# Altium project e.PrjPcb
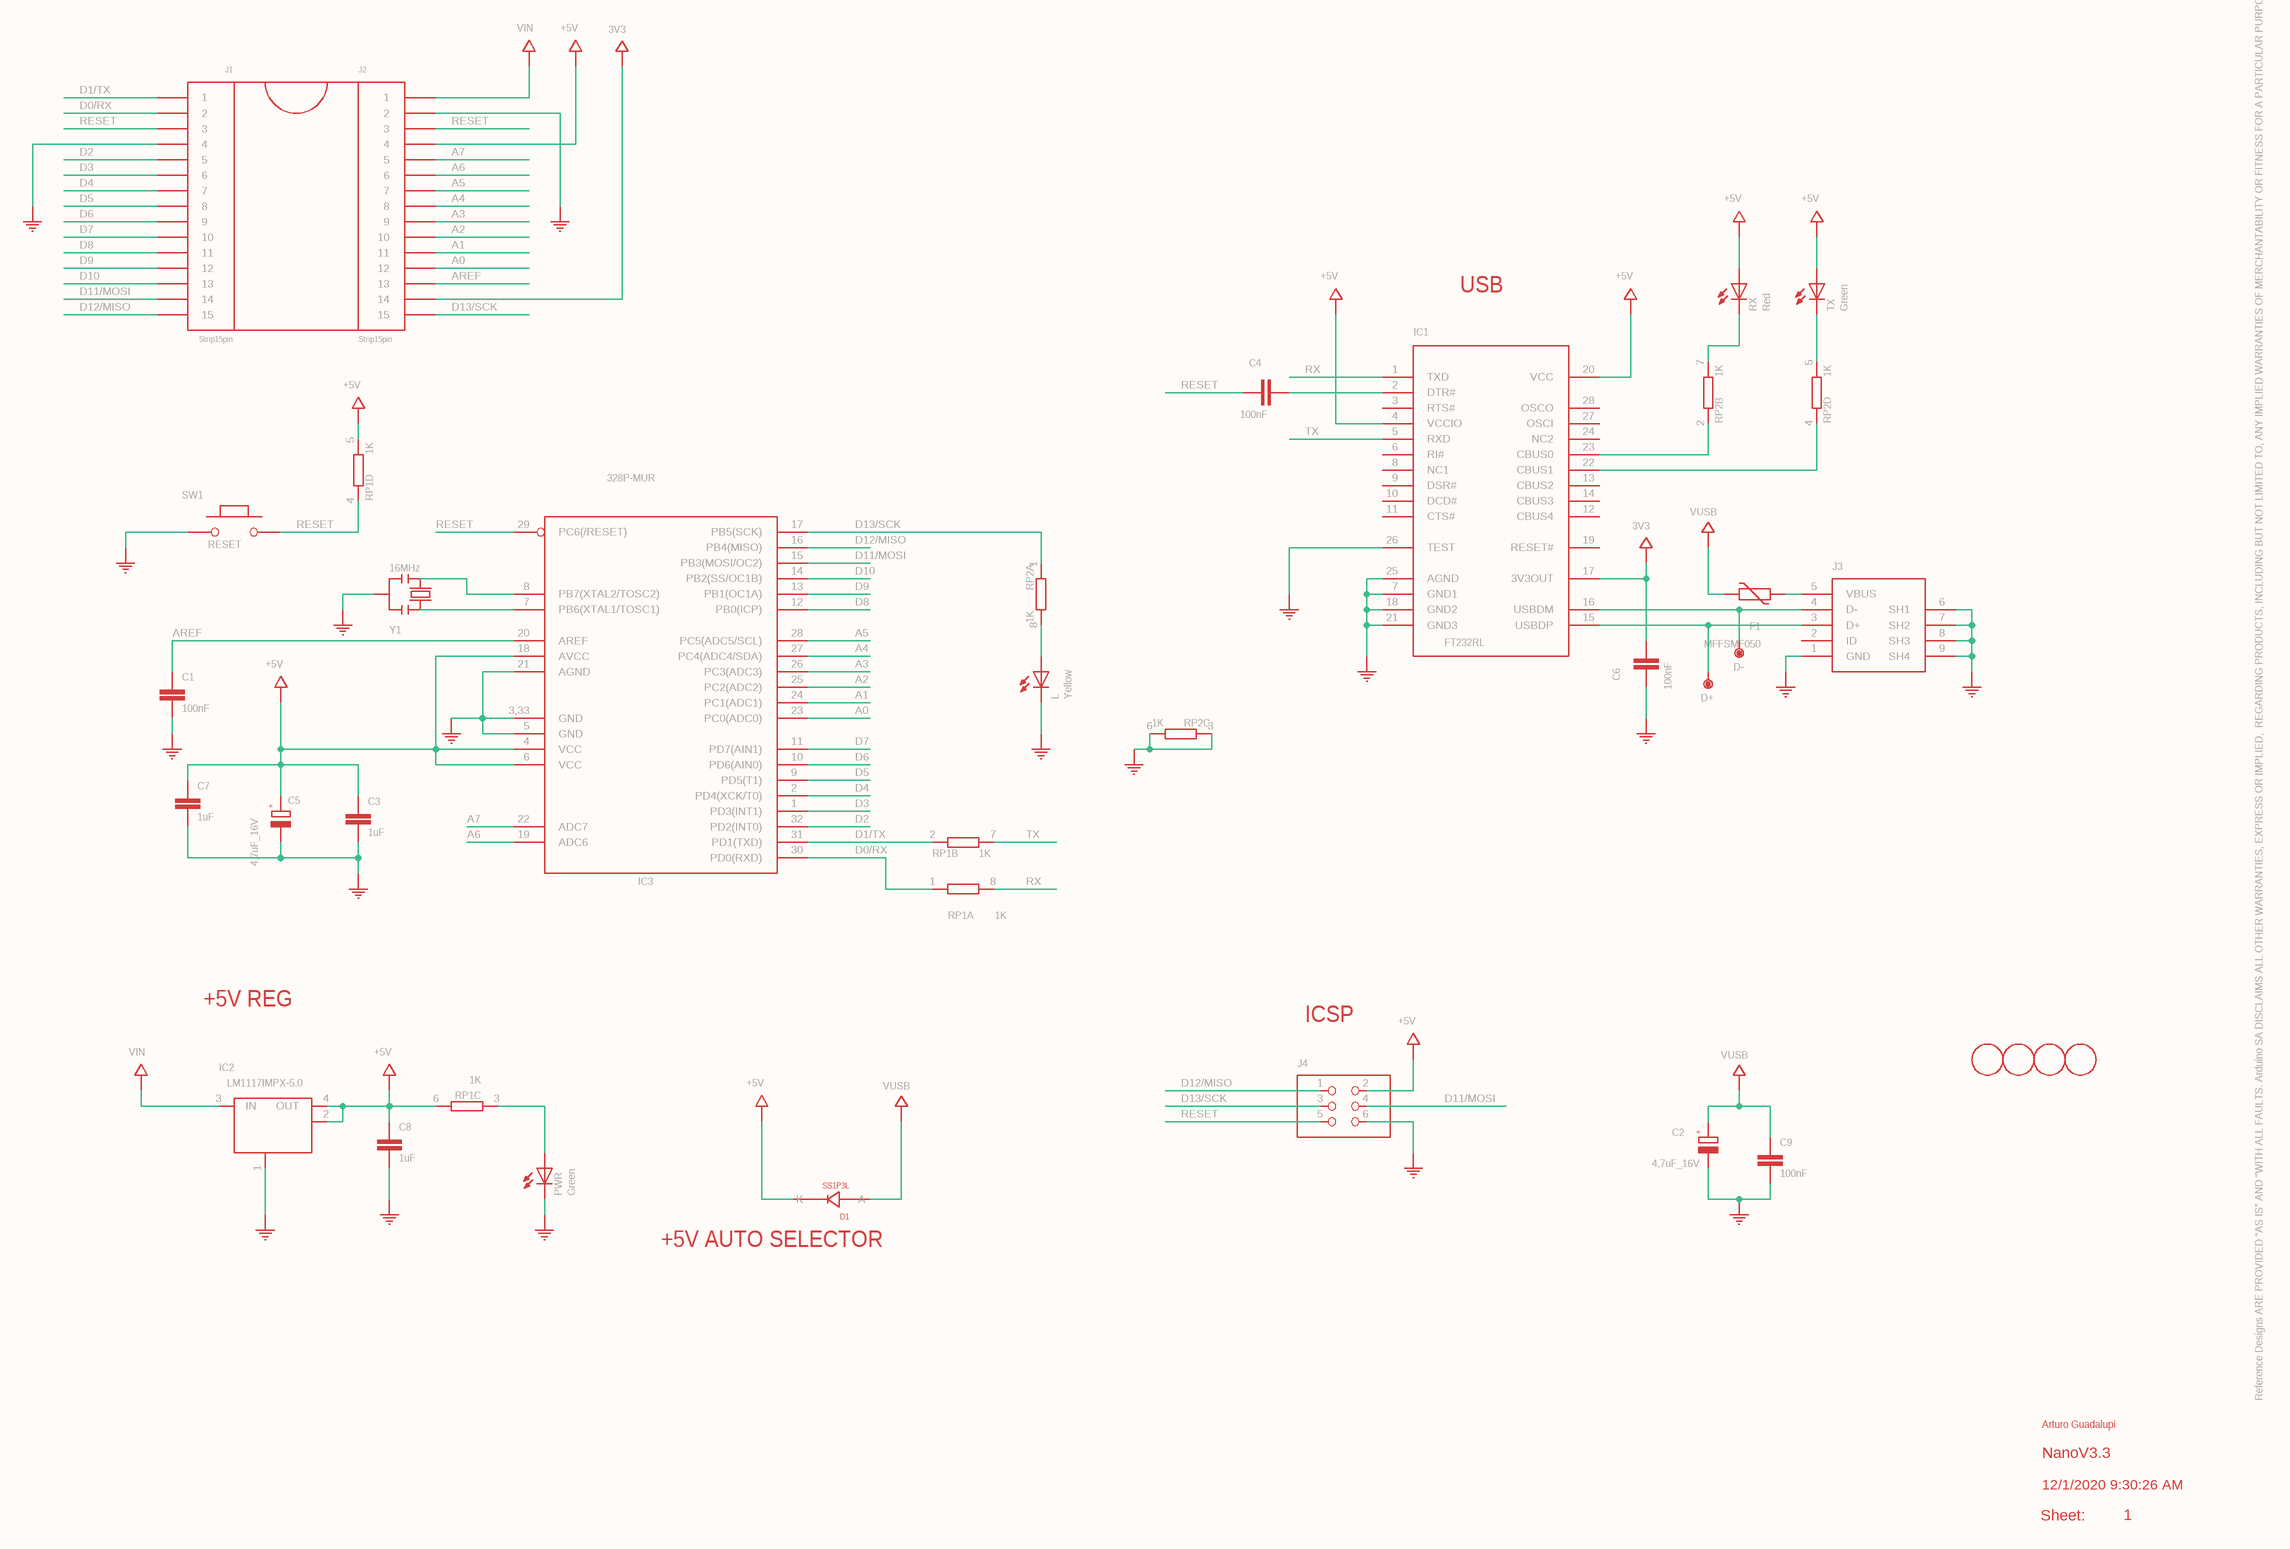
[diagram p0: NanoV3.3.SchDoc]
1 sheet, 68 parts. Net scope: global (net labels, ports and power ports of the same name join across sheets).
Board file: NanoV3.3.PcbDoc

## Sheet NanoV3.3.SchDoc: NanoV3.3
size 409 x 289 mm; Origin: Eagle; Date: 12/1/2020 9:30:26 AM; SheetNumber: 1; CODE-ARDUINO: DNP; DATASHEET: DNP; DISTRIBUTOR-LINK: DNP; DISTRIBUTOR-PN: DNP; MANUFACTURER: DNP; MANUFACTURER-PN: DNP; NOTE: DNP; Value: DNP; GateName_1: G$1; SymbolName_1: A3L-LOC; LibraryName: Arduino-utility; DeviceSetName: A3-FRAME; Sheet: Sheet:; ReferenceDesignsAREPROVIDED"ASIS"AND"WITHALLFAULTS.ArduinoSADISCLAIMSALLOTHERWARRANTIES,EXPRESSORIMPLIED,
REGARDINGPRODUCTS,INCLUDINGBUTNOTLIMITEDTO,ANYIMPLIEDWARRANTIESOFMERCHANTABILITYORFITNESSFORAPARTICULARPURPOSE

ArduinoSAmaymakechangestospecificationsandproductdescriptionsatanytime,withoutnotice.TheCustomermustnot
relyontheabsenceorcharacteristicsofanyfeaturesorinstructionsmarked"reserved"or"undefined."ArduinoSAreserves
theseforfuturedefinitionandshallhavenoresponsibilitywhatsoeverforconflictsorincompatibilitiesarisingfromfuturechangestothem.
TheproductinformationontheWebSiteorMaterialsissubjecttochangewithoutnotice.Donotfinalizeadesignwiththisinfo

ARDUINOandotherArduinobrandsandlogosandTrademarksofArduinoSA.AllArduinoSATrademarkscannotbeusedwithoutowner'sformalpermission: Reference Designs ARE PROVIDED "AS IS" AND "WITH ALL FAULTS. Arduino SA DISCLAIMS ALL OTHER WARRANTIES, EXPRESS OR IMPLIED, / REGARDING PRODUCTS, INCLUDING BUT NOT LIMITED TO, ANY IMPLIED WARRANTIES OF MERCHANTABILITY OR FITNESS FOR A PARTICULAR PURPOSE / Arduino SA may make changes to specifications and product descriptions at any time, without notice. The Customer must not / rely on the absence or characteristics of any features or instructions marked "reserved" or "undefined." Arduino SA reserves / these for future definition and shall have no responsibility whatsoever for conflicts or incompatibilities arising from future changes to them. / The product information on the Web Site or Materials is subject to change without notice. Do not finalize a design with this info / ARDUINO and other Arduino brands and logos and Trademarks of Arduino SA. All Arduino SA Trademarks cannot be used without owner's formal permission

### Parts
C1  100nF  [C0603-ROUND]
C2  4,7uF_16V  [TAN-A]
C3  1uF  [C0603-ROUND]
C4  100nF  [C0603-ROUND]
C5  4,7uF_16V  [TAN-A]
C6  100nF  [C0603-ROUND]
C7  1uF  [C0603-ROUND]
C8  1uF  [C0603-ROUND]
C9  100nF  [C0603-ROUND]
D1  SS1P3L  [DO220AAL]
D+  DNP  [TP-1.00MM]  (value not drawn)
D-  DNP  [TP-1.00MM]  (value not drawn)
F1  MFFSMF050  [0603-1608X90N]
IC1  FT232RL  [SSOP28]
IC2  LM1117IMPX-5.0  [LINEAR_SOT223]
IC3  328P-MUR  [VQFN32]
J1  Strip15pin  [HEAD15-NOSS]
J2  Strip15pin  [HEAD15-NOSS]
J3  USB-mini-90 -SMD  [USB-MINI-B_2]  (value not drawn)
J4  ICSP  [2X03]  (value not drawn)
L  Yellow  [CHIPLED_0805]
PWR  Green  [CHIPLED_0805]
RP1  1K  [CAY16]  (parts A,B,C,D of 4)
RP2  1K  [CAY16]  (parts A,B,C,D of 4)
RX  Red  [CHIPLED_0805]
SW1  RESET  [SMD_157SW]
TX  Green  [CHIPLED_0805]
U$1  COM  (value not drawn)
U$2  COM  (value not drawn)
U$3  COM  (value not drawn)
U$4  DNP  [FD-1-1.5]  (value not drawn)
U$5  DNP  [FD-1-1.5]  (value not drawn)
U$6  +5V
U$7  VIN
U$8  3V3
U$9  COM  (value not drawn)
U$10  COM  (value not drawn)
U$11  +5V
U$12  +5V
U$13  COM  (value not drawn)
U$14  +5V
U$15  +5V
U$16  COM  (value not drawn)
U$17  COM  (value not drawn)
U$18  +5V
U$19  VIN
U$20  COM  (value not drawn)
U$21  VUSB
U$22  VUSB
U$23  VUSB
U$24  COM  (value not drawn)
U$25  +5V
U$26  3V3
U$27  COM  (value not drawn)
U$28  COM  (value not drawn)
U$29  COM  (value not drawn)
U$30  COM  (value not drawn)
U$31  +5V
U$32  COM  (value not drawn)
U$33  COM  (value not drawn)
U$34  COM  (value not drawn)
U$35  +5V
U$51  COM  (value not drawn)
U$52  COM  (value not drawn)
U$53  DNP  [FD-1-1.5]  (value not drawn)
U$54  DNP  [FD-1-1.5]  (value not drawn)
U$55  +5V
Y1  16MHz  [RESONATOR]

### Nets
A0: IC3.23(PC0(ADC0)) J2.12
A1: IC3.24(PC1(ADC1)) J2.11
A2: IC3.25(PC2(ADC2)) J2.10
A3: IC3.26(PC3(ADC3)) J2.9
A4: IC3.27(PC4(ADC4/SDA)) J2.8
A5: IC3.28(PC5(ADC5/SCL)) J2.7
A6: IC3.19(ADC6) J2.6
A7: IC3.22(ADC7) J2.5
AREF: C1.1 IC3.20(AREF) J2.13
D0/RX: IC3.30(PD0(RXD)) J1.2 RP1.1
D1/TX: IC3.31(PD1(TXD)) J1.1 RP1.2
D2: IC3.32(PD2(INT0)) J1.5
D3: IC3.1(PD3(INT1)) J1.6
D4: IC3.2(PD4(XCK/T0)) J1.7
D5: IC3.9(PD5(T1)) J1.8
D6: IC3.10(PD6(AIN0)) J1.9
D7: IC3.11(PD7(AIN1)) J1.10
D8: IC3.12(PB0(ICP)) J1.11
D9: IC3.13(PB1(OC1A)) J1.12
D10: IC3.14(PB2(SS/OC1B)) J1.13
D11/MOSI: IC3.15(PB3(MOSI/OC2)) J1.14 J4.4
D12/MISO: IC3.16(PB4(MISO)) J1.15 J4.1
D13/SCK: IC3.17(PB5(SCK)) J2.15 J4.3 RP2.1
RESET: C4.1 IC3.29(PC6(/RESET)) J1.3 J2.3 J4.5 RP1.4 SW1.2
RX: IC1.1(TXD) RP1.8
TX: IC1.5(RXD) RP1.7
NetC1_2: C1.2 U$10.?1(COM)
NetC2_1: C2.1(+) C9.1 U$23.?1(VUSB)
NetC2_2: C2.2(-) C9.2 U$17.?1(COM)
NetC3_1: C3.1 C5.1(+) C7.1 IC3.4(VCC) IC3.6(VCC) IC3.18(AVCC) U$55.?1(+5V)
NetC3_2: C3.2 C5.2(-) C7.2 U$16.?1(COM)
NetC4_2: C4.2 IC1.2(DTR#)
NetC6_1: C6.1 U$27.?1(COM)
NetC6_2: C6.2 IC1.17(3V3OUT) U$26.?1(3V3)
NetC8_1: C8.1 IC2.2(OUT) IC2.4(OUT) RP1.6 U$18.?1(+5V)
NetC8_2: C8.2 U$20.?1(COM)
NetD1_P$1: D1.P$1(K) U$15.?1(+5V)
NetD1_P$2: D1.P$2(A) U$21.?1(VUSB)
NetD+_X: D+.X(P$1) IC1.15(USBDP) J3.3(D+)
NetD-_X: D-.X(P$1) IC1.16(USBDM) J3.4(D-)
NetF1_1: F1.1 U$22.?1(VUSB)
NetF1_2: F1.2 J3.5(VBUS)
NetIC1_4: IC1.4(VCCIO) U$11.?1(+5V)
NetIC1_7: IC1.7(GND1) IC1.18(GND2) IC1.21(GND3) IC1.25(AGND) U$24.?1(COM)
NetIC1_20: IC1.20(VCC) U$14.?1(+5V)
NetIC1_22: IC1.22(CBUS1) RP2.4
NetIC1_23: IC1.23(CBUS0) RP2.2
NetIC1_26: IC1.26(TEST) U$51.?1(COM)
NetIC2_1: IC2.1(GND/ADJ) U$32.?1(COM)
NetIC2_3: IC2.3(IN) U$19.?1(VIN)
NetIC3_3,33: IC3.3,33(GND) IC3.5(GND) IC3.21(AGND) U$52.?1(COM)
NetIC3_7: IC3.7(PB6(XTAL1/TOSC1)) Y1.1
NetIC3_8: IC3.8(PB7(XTAL2/TOSC2)) Y1.3
NetJ1_4: J1.4 U$1.?1(COM)
NetJ2_1: J2.1 U$7.?1(VIN)
NetJ2_2: J2.2 U$2.?1(COM)
NetJ2_4: J2.4 U$6.?1(+5V)
NetJ2_14: J2.14 U$8.?1(3V3)
NetJ3_1: J3.1(GND) U$29.?1(COM)
NetJ3_6: J3.6(SH1) J3.7(SH2) J3.8(SH3) J3.9(SH4) U$30.?1(COM)
NetJ4_2: J4.2 U$12.?1(+5V)
NetJ4_6: J4.6 U$3.?1(COM)
NetL_A: L.A RP2.8
NetL_C: L.C U$34.?1(COM)
NetPWR_A: PWR.A RP1.3
NetPWR_C: PWR.C U$33.?1(COM)
NetRP1_5: RP1.5 U$31.?1(+5V)
NetRP2_3: RP2.3 RP2.6 U$9.?1(COM)
NetRP2_5: RP2.5 TX.C
NetRP2_7: RP2.7 RX.C
NetRX_A: RX.A U$25.?1(+5V)
NetSW1_1: SW1.1 U$28.?1(COM)
NetTX_A: TX.A U$35.?1(+5V)
NetU$13_?1: U$13.?1(COM) Y1.2

Not connected (* = marked no-connect by the designer): IC1 3(RTS#) 6(RI#) 8(NC1) 9(DSR#) 10(DCD#) 11(CTS#) 12(CBUS4) 13(CBUS2) 14(CBUS3) 19(RESET#) 24(NC2) 27(OSCI) 28(OSCO); J3 2(ID)

### Notes on the sheet
- USB
- +5V REG
- ICSP
- (near D1) +5V AUTO SELECTOR
- Reference Designs ARE PROVIDED "AS IS" AND "WITH ALL FAULTS. Arduino SA DISCLAIMS ALL OTHER WARRANTIES, EXPRESS OR IMPLIED,
  REGARDING PRODUCTS, INCLUDING BUT NOT LIMITED TO, ANY IMPLIED WARRANTIES OF MERCHANTABILITY OR FITNESS FOR A PARTICULAR PURPOSE
  Arduino SA may make changes to specifications and product descriptions at any time, without notice. The Customer must not
  rely on the absence or characteristics of any features or instructions marked "reserved" or "undefined." Arduino SA reserves
  these for future definition and shall have no responsibility whatsoever for conflicts or incompatibilities arising from future changes to them.
  The product information on the Web Site or Materials is subject to change without notice. Do not finalize a design with this info
  ARDUINO and other Arduino brands and logos and Trademarks of Arduino SA. All Arduino SA Trademarks cannot be used without owner's formal permission
- Arturo Guadalupi
- NanoV3.3
- Sheet:
- 12/1/2020 9:30:26 AM
- 1

### Library data of the parts
C1 C4 C6 C9 = 0015_100NF_0603: 100nF 0603 50V; PART_NUMBER: cl10b104kbnc; GateName_1: G$1; SymbolName_1: C-EU; MONTHLY_USAGE: _____; TYPE: Condensatori; LibraryName: Condensatori; DeviceSetName: 0015_100NF_0603; CASE: 0603; PRICE: _____; SUPPLIER: _____
C2 C5 = 0833_TAJA475MO16RNJ: 4,7uF; GateName_1: G$1; SymbolName_1: CPOL; MONTHLY_USAGE: _____; TYPE: Condensatori; LibraryName: Condensatori; DeviceSetName: 0833_TAJA475MO16RNJ; +: +; CASE: Case_A_(1206); PART_NUMBER: TAJA475MO16RNJ; PRICE: _____; SUPPLIER: _____
C3 C7 C8 = 0006_1UF_0603/GRM188R61E105KA12D: 1uF 0603; GateName_1: G$1; SymbolName_1: C-EU; MONTHLY_USAGE: _____; TYPE: Condensatori; LibraryName: Condensatori; DeviceSetName: 0006_1UF_0603/GRM188R61E105KA12D; CASE: 0603; PART_NUMBER: 1uF_0603/GRM188R61E105KA12D; PRICE: _____; SUPPLIER: _____
D1 = 0025_SS1P3L-M3/84A: 1A 30V Schottky Barrier Rectifiers -SS1P3L-M3/84A; GateName_1: G$1; SymbolName_1: DIODE; MONTHLY_USAGE: _____; TYPE: Diodi; LibraryName: Diodi; DeviceSetName: 0025_SS1P3L-M3/84A; CASE: SMP; PART_NUMBER: SS1P3L-M3/84A; PRICE: _____; SUPPLIER: _____
D+ D- = TPTP-1.00MM: Testpoint; GateName_1: G$1; DeviceSetName: TP; SymbolName_1: TESTPOINT; DeviceName: TP-1.00MM; LibraryName: Arduino-utility; DATASHEET: DNP; DISTRIBUTOR-LINK: DNP; DISTRIBUTOR-PN: DNP; MANUFACTURER: DNP; MANUFACTURER-PN: DNP
F1 = PTC: SMD PTC; MANUFACTURER: Bourns Inc; MANUFACTURER-PN: MF-FSMF050X-2; GateName_1: G$1; SymbolName_1: PTC; LibraryName: Arduino-rcl; DeviceSetName: PTC; DATASHEET: http://www.bourns.com/docs/Product-Datasheets/mffsmf.pdf; DISTRIBUTOR-LINK: http://www.digikey.com/product-detail/en/bourns-inc/MF-FSMF050X-2/MF-FSMF050X-2CT-ND/2039389; DISTRIBUTOR-PN: MF-FSMF050X-2CT-ND
IC1 = 0226_FT232RL: USB to serial UART interface -FT232RL; GateName_1: G$1; SymbolName_1: FL232RL; MONTHLY_USAGE: _____; LibraryName: IntegratedCircuits; DeviceSetName: 0226_FT232RL; CASE: SSOP28; PART_NUMBER: FT232RL; PRICE: _____; SUPPLIER: _____; TYPE: Circuito_Integrato
IC2 = 0022_LM1117IMPX-5.0: Low-dropout linear regulator 5V  -LM1117IMPX-5.0; GateName_1: G$1; SymbolName_1: LINEAR_VREG-O2; MONTHLY_USAGE: _____; LibraryName: IntegratedCircuits; DeviceSetName: 0022_LM1117IMPX-5.0; CASE: SOT223; PART_NUMBER: LM1117IMPX-5.0; PRICE: _____; SUPPLIER: _____; TYPE: Circuito_Integrato
IC3 = ATMEGA328P-32MUR: 8-bit Microcontroller with 32KBytes In-System Programmable Flash   ATMEGA328P-AU; MANUFACTURER: ATMEL; MANUFACTURER-PN: ATMEGA328P-MUR; GateName_1: G$1; SymbolName_1: 23-I/O; DeviceName: MUR; LibraryName: Arduino-ucs&SoCs; DeviceSetName: ATMEGA328P-32; DATASHEET: http://www.atmel.com/images/Atmel-8271-8-bit-AVR-Microcontroller-ATmega48A-48PA-88A-88PA-168A-168PA-328-328P_datasheet_Complete.pdf; DISTRIBUTOR-LINK: https://www.digikey.it/product-detail/it/microchip-technology/ATMEGA328P-MUR/ATMEGA328P-MURCT-ND/3440953; DISTRIBUTOR-PN: ATMEGA328P-MURCT-ND
J1 J2 = XXXX_STRIPNANO: Strip passo 2,54 a 15 pin  per Arduino Nano; GateName_1: G$1; SymbolName_1: HEAD15-NOSS; LibraryName: Connettori; DeviceSetName: XXXX_STRIPNANO
J3 = 0219_14850: Usb-Mini F 90  Smd; PART_NUMBER: 14850; GateName_1: G$1; SymbolName_1: USB; MONTHLY_USAGE: _____; LibraryName: Connettori; DeviceSetName: 0219_14850; CASE: CASE; PRICE: _____; SUPPLIER: _____; TYPE: Connettori
J4 = 0114_PH254-203DF118A00V: 3x2 M V h 8,5 mm p2,54; GateName_1: A; SymbolName_1: PINH2X3; MONTHLY_USAGE: _____; LibraryName: Connettori; DeviceSetName: 0114_PH254-203DF118A00V; CASE: CASE; PART_NUMBER: PH254-203DF118A00V; PRICE: _____; SUPPLIER: _____; TYPE: Connettori
L = 0044_KPT-2012YC: LED YELLOW - SMD - 0805; GateName_1: G$1; MONTHLY_USAGE: _____; SymbolName_1: LED; LibraryName: Opto; DeviceSetName: 0044_KPT-2012YC; CASE: CASE; PART_NUMBER: KPT-2012YC; PRICE: _____; SUPPLIER: _____; TYPE: Opto
PWR TX = 0043_KPT-2012SGC: LED GREEN - SMD-0805; GateName_1: G$1; MONTHLY_USAGE: _____; SymbolName_1: LED; LibraryName: Opto; DeviceSetName: 0043_KPT-2012SGC; CASE: CASE; PART_NUMBER: KPT-2012SGC; PRICE: _____; SUPPLIER: _____; TYPE: Opto
RP1 RP2 = 0005_064R_1K_/_CAY16-102J4LF: 1K 064R; GateName_1: A; SymbolName_1: R1NV; GateName_2: B; GateName_3: C; GateName_4: D; MONTHLY_USAGE: _____; SymbolName_2: R1NV; SymbolName_3: R1NV; SymbolName_4: R1NV; LibraryName: Resistenze; DeviceSetName: 0005_064R_1K_/_CAY16-102J4LF; CASE: SMD_3,2x1,6; PART_NUMBER: 064R_1K_/_CAY16-102J4LF; PRICE: _____; SUPPLIER: _____; TYPE: Resistenze
RX = 0181_KTP-2012SURCK: LED RED - SMD - 0805; GateName_1: G$1; MONTHLY_USAGE: _____; SymbolName_1: LED; LibraryName: Opto; DeviceSetName: 0181_KTP-2012SURCK; CASE: CASE; PART_NUMBER: KTP-2012SURCK; PRICE: _____; SUPPLIER: _____; TYPE: Opto
SW1 = 0173_IT-1185AP1C-160G-G_T&R: Pushbutton 4x3 SMD H2,5mm; GateName_1: G$1; SymbolName_1: MYSMD_PBSWITCH; MONTHLY_USAGE: _____; LibraryName: Switches; DeviceSetName: 0173_IT-1185AP1C-160G-G_T&R; CASE: CASE; PART_NUMBER: IT-1185AP1C-160G-G_T&R; PRICE: _____; SUPPLIER: _____; TYPE: Switches
U$1-U$3 U$9 U$10 U$13 U$16 U$17 U$20 U$24 U$27-U$30 U$32-U$34 U$51 U$52 = COM: GateName_1: G$1; SymbolName_1: COM; LibraryName: MyPOW; DeviceSetName: COM
U$4 U$5 U$53 U$54 = FIDUCIAL-1.5MM: Fiducial mount; GateName_1: G$1; SymbolName_1: ARDUINO_FIDUCIAL; DeviceName: -1.5MM; LibraryName: Arduino-utility; DeviceSetName: FIDUCIAL; DATASHEET: DNP; DISTRIBUTOR-LINK: DNP; DISTRIBUTOR-PN: DNP; MANUFACTURER: DNP; MANUFACTURER-PN: DNP
U$6 U$11 U$12 U$14 U$15 U$18 U$25 U$31 U$35 U$55 = +5V: GateName_1: G$1; SymbolName_1: +5V; LibraryName: MyPOW; DeviceSetName: +5V
U$7 U$19 = VIN: GateName_1: G$1; SymbolName_1: VIN; LibraryName: MyPOW; DeviceSetName: VIN
U$8 U$26 = 3V3: GateName_1: G$1; SymbolName_1: 3V3; LibraryName: MyPOW; DeviceSetName: 3V3
U$21-U$23 = VUSB: GateName_1: G$1; SymbolName_1: VUSB; LibraryName: MyPOW; DeviceSetName: VUSB
Y1 = 0011_CSTCE16M0V53-R0: 16Mhz - SMD; GateName_1: G$1; MONTHLY_USAGE: _____; SymbolName_1: RESONATOR; LibraryName: Cristalli; DeviceSetName: 0011_CSTCE16M0V53-R0; CASE: CASE; PART_NUMBER: CSTCE16M0V53-R0; PRICE: _____; SUPPLIER: _____; TYPE: Cristalli